# Altium schematic sheet 手柄.SchDoc
size A2
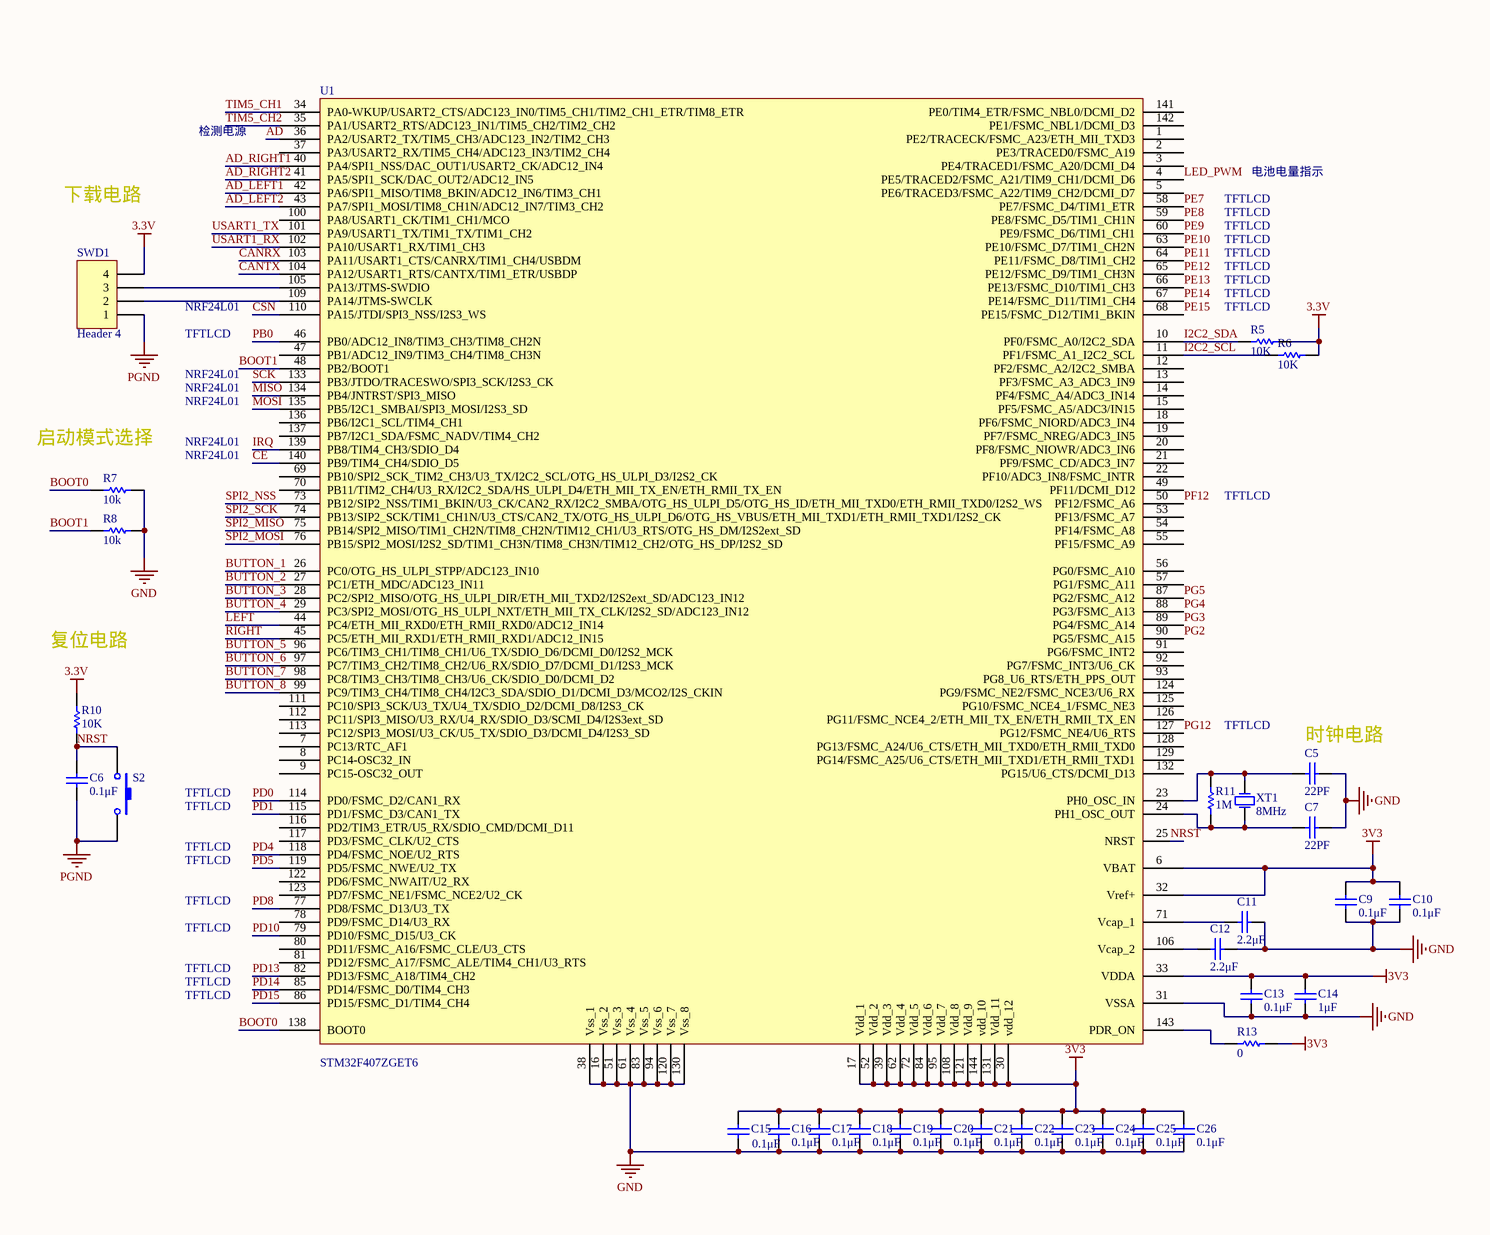
[diagram p0: 手柄.SchDoc, left]
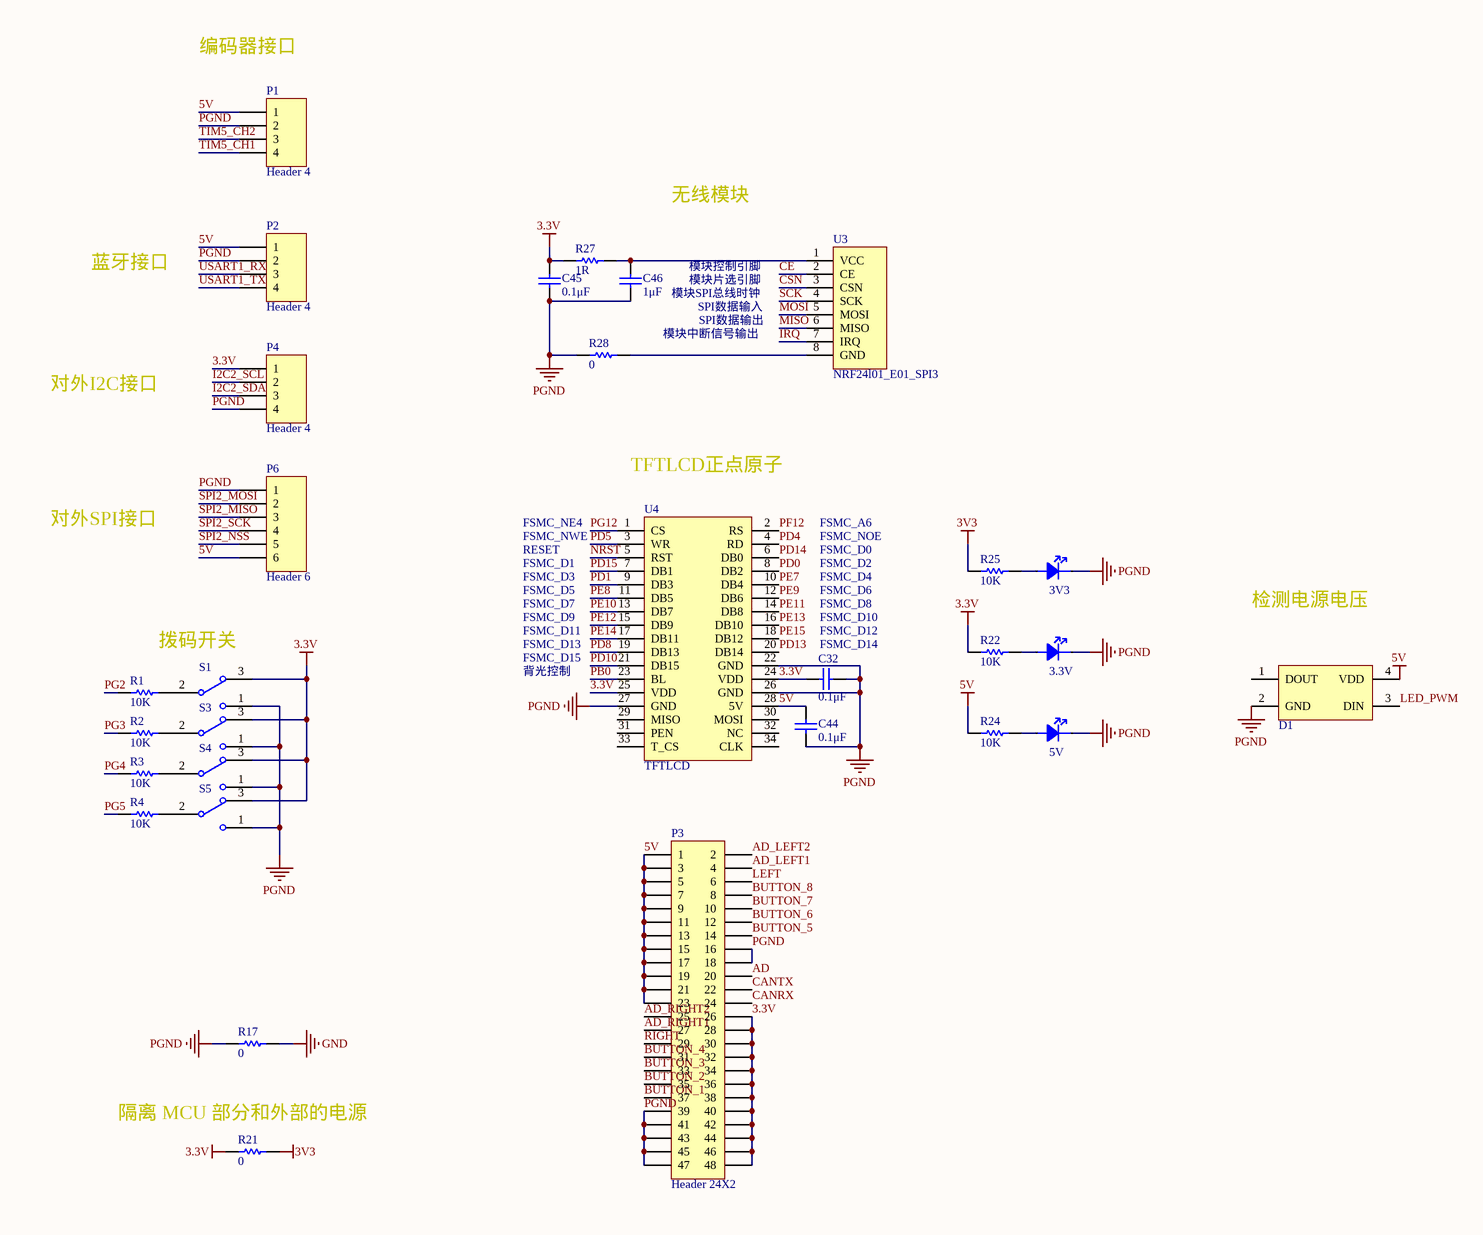
[diagram p1: 手柄.SchDoc, right]

## Parts
3.3V  lED  [0805D]  (value not drawn)
3V3  lED  [0805D]  (value not drawn)
5V  lED  [0805D]  (value not drawn)
C5  22PF  [CAP-MLCC-0603]
C6  0.1μF  [CAP-MLCC-0603]
C7  22PF  [CAP-MLCC-0603]
C9  0.1μF  [CAP-MLCC-0603]
C10  0.1μF  [CAP-MLCC-0603]
C11  2.2μF  [CAP-MLCC-0603]
C12  2.2μF  [CAP-MLCC-0603]
C13  0.1μF  [CAP-MLCC-0603]
C14  1μF  [CAP-MLCC-0603]
C15  0.1μF  [CAP-MLCC-0603]
C16  0.1μF  [CAP-MLCC-0603]
C17  0.1μF  [CAP-MLCC-0603]
C18  0.1μF  [CAP-MLCC-0603]
C19  0.1μF  [CAP-MLCC-0603]
C20  0.1μF  [CAP-MLCC-0603]
C21  0.1μF  [CAP-MLCC-0603]
C22  0.1μF  [CAP-MLCC-0603]
C23  0.1μF  [CAP-MLCC-0603]
C24  0.1μF  [CAP-MLCC-0603]
C25  0.1μF  [CAP-MLCC-0603]
C26  0.1μF  [CAP-MLCC-0603]
C32  0.1μF  [CAP-MLCC-0603]
C44  0.1μF  [CAP-MLCC-0603]
C45  0.1μF  [CAP-MLCC-0603]
C46  1μF  [CAP-MLCC-0603]
D1  LED_3535_SK6812  [LED_3535_4P]  (value not drawn)
P1  Header 4  [HDR1X4]
P2  Header 4  [HDR1X4]
P3  Header 24X2  [手柄下板]
P4  Header 4  [HDR1X4]
P6  Header 6  [Header 6]
R1  value 10K  [RES-0603]  (hidden comment: Res1)
R2  value 10K  [RES-0603]  (hidden comment: Res1)
R3  value 10K  [RES-0603]  (hidden comment: Res1)
R4  value 10K  [RES-0603]  (hidden comment: Res1)
R5  value 10K  [RES-0603]  (hidden comment: Res1)
R6  value 10K  [RES-0603]  (hidden comment: Res1)
R7  value 10k  [RES-0603]  (hidden comment: Res1)
R8  value 10k  [RES-0603]  (hidden comment: Res1)
R10  value 10K  [RES-0603]  (hidden comment: Res1)
R11  value 1M  [RES-0603]  (hidden comment: Res1)
R13  value 0  [RES-0603]  (hidden comment: Res1)
R17  value 0  [RES-0603]  (hidden comment: Res1)
R21  value 0  [RES-0603]  (hidden comment: Res1)
R22  value 10K  [RES-0603]  (hidden comment: Res1)
R24  value 10K  [RES-0603]  (hidden comment: Res1)
R25  value 10K  [RES-0603]  (hidden comment: Res1)
R27  value 1R  [RES-0603]  (hidden comment: Res1)
R28  value 0  [RES-0603]  (hidden comment: Res1)
S1  SW-SPDT  [拨码开关]  (value not drawn)
S2  SW-PB  [KEY]  (value not drawn)
S3  SW-SPDT  [拨码开关]  (value not drawn)
S4  SW-SPDT  [拨码开关]  (value not drawn)
S5  SW-SPDT  [拨码开关]  (value not drawn)
SWD1  Header 4  [HDR1X4]
U1  STM32F407ZGET6  [LQFP144-L]
U3  NRF24l01_E01_SPI3  [E01-ML01SP2]
U4  TFTLCD  [TFTLCD]
XT1  value 8MHz  [XT_5032_2]  (hidden comment: XTAL_5032_2P)

## Nets
3.3V: C32.1 C45.2 P3.26 P3.28 P3.30 P3.32 P3.34 P3.36 P3.38 P3.40 P3.42 P3.44 P3.46 P3.48 P4.1 R5.2 R6.2 R10.1 R21.1 R22.1 R27.1 S1.3 S3.3 S4.3 S5.3 SWD1.4 U4.24(VDD) U4.25(VDD)
3V3: C9.2 C10.2 C13.2 C14.2 C15.2 C16.2 C17.2 C18.2 C19.2 C20.2 C21.2 C22.2 C23.2 C24.2 C25.2 C26.2 R13.2 R21.2 R25.1 U1.6(VBAT) U1.17(Vdd_1) U1.30(vdd_12) U1.32(Vref+) U1.33(VDDA) U1.39(Vdd_3) U1.52(Vdd_2) U1.62(Vdd_4) U1.72(Vdd_5) U1.84(Vdd_6) U1.95(Vdd_7) U1.108(Vdd_8) U1.121(Vdd_9) U1.131(Vdd_11) U1.144(vdd_10)
5V: C44.1 D1.4(VDD) P1.1 P2.1 P3.1 P3.3 P3.5 P3.7 P3.9 P3.11 P3.13 P3.15 P3.17 P3.19 P3.21 P3.23 P6.6 R24.1 U4.28(5V)
GND: C5.2 C7.2 C9.1 C10.1 C11.2 C12.2 C13.1 C14.1 C15.1 C16.1 C17.1 C18.1 C19.1 C20.1 C21.1 C22.1 C23.1 C24.1 C25.1 C26.1 R7.2 R8.2 R17.2 U1.16(Vss_2) U1.31(VSSA) U1.38(Vss_1) U1.51(Vss_3) U1.61(Vss_4) U1.83(Vss_5) U1.94(Vss_6) U1.120(Vss_7) U1.130(Vss_8)
PGND: 3.3V.K 3V3.K 5V.K C6.1 C32.2 C44.2 C45.1 C46.1 D1.2(GND) P1.2 P2.2 P3.16 P3.18 P3.39 P3.41 P3.43 P3.45 P3.47 P4.4 P6.1 R17.1 R28.1 S1.1 S2.2 S3.1 S4.1 S5.1 SWD1.1 U4.22(GND) U4.26(GND) U4.27(GND)
AD: P3.20 U1.36(PA2/USART2_TX/TIM5_CH3/ADC123_IN2/TIM2_CH3)
AD_LEFT1: P3.4 U1.42(PA6/SPI1_MISO/TIM8_BKIN/ADC12_IN6/TIM3_CH1)
AD_LEFT2: P3.2 U1.43(PA7/SPI1_MOSI/TIM8_CH1N/ADC12_IN7/TIM3_CH2)
AD_RIGHT1: P3.27 U1.40(PA4/SPI1_NSS/DAC_OUT1/USART2_CK/ADC12_IN4)
AD_RIGHT2: P3.25 U1.41(PA5/SPI1_SCK/DAC_OUT2/ADC12_IN5)
BOOT0: R7.1 U1.138(BOOT0)
BOOT1: R8.1 U1.48(PB2/BOOT1)
BUTTON_1: P3.37 U1.26(PC0/OTG_HS_ULPI_STPP/ADC123_IN10)
BUTTON_2: P3.35 U1.27(PC1/ETH_MDC/ADC123_IN11)
BUTTON_3: P3.33 U1.28(PC2/SPI2_MISO/OTG_HS_ULPI_DIR/ETH_MII_TXD2/I2S2ext_SD/ADC123_IN12)
BUTTON_4: P3.31 U1.29(PC3/SPI2_MOSI/OTG_HS_ULPI_NXT/ETH_MII_TX_CLK/I2S2_SD/ADC123_IN12)
BUTTON_5: P3.14 U1.96(PC6/TIM3_CH1/TIM8_CH1/U6_TX/SDIO_D6/DCMI_D0/I2S2_MCK)
BUTTON_6: P3.12 U1.97(PC7/TIM3_CH2/TIM8_CH2/U6_RX/SDIO_D7/DCMI_D1/I2S3_MCK)
BUTTON_7: P3.10 U1.98(PC8/TIM3_CH3/TIM8_CH3/U6_CK/SDIO_D0/DCMI_D2)
BUTTON_8: P3.8 U1.99(PC9/TIM3_CH4/TIM8_CH4/I2C3_SDA/SDIO_D1/DCMI_D3/MCO2/I2S_CKIN)
CANRX: P3.24 U1.103(PA11/USART1_CTS/CANRX/TIM1_CH4/USBDM)
CANTX: P3.22 U1.104(PA12/USART1_RTS/CANTX/TIM1_ETR/USBDP)
CE: U1.140(PB9/TIM4_CH4/SDIO_D5) U3.2(CE)
CSN: U1.110(PA15/JTDI/SPI3_NSS/I2S3_WS) U3.3(CSN)
I2C2_SCL: P4.2 R6.1 U1.11(PF1/FSMC_A1_I2C2_SCL)
I2C2_SDA: P4.3 R5.1 U1.10(PF0/FSMC_A0/I2C2_SDA)
IRQ: U1.139(PB8/TIM4_CH3/SDIO_D4) U3.7(IRQ)
LED_PWM: D1.3(DIN) U1.4(PE5/TRACED2/FSMC_A21/TIM9_CH1/DCMI_D6)
LEFT: P3.6 U1.44(PC4/ETH_MII_RXD0/ETH_RMII_RXD0/ADC12_IN14)
MISO: U1.134(PB4/JNTRST/SPI3_MISO) U3.6(MISO)
MOSI: U1.135(PB5/I2C1_SMBAI/SPI3_MOSI/I2S3_SD) U3.5(MOSI)
NRST: C6.2 R10.2 S2.1 U1.25(NRST) U4.5(RST)
PB0: U1.46(PB0/ADC12_IN8/TIM3_CH3/TIM8_CH2N) U4.23(BL)
PD0: U1.114(PD0/FSMC_D2/CAN1_RX) U4.8(DB2)
PD1: U1.115(PD1/FSMC_D3/CAN1_TX) U4.9(DB3)
PD4: U1.118(PD4/FSMC_NOE/U2_RTS) U4.4(RD)
PD5: U1.119(PD5/FSMC_NWE/U2_TX) U4.3(WR)
PD8: U1.77(PD8/FSMC_D13/U3_TX) U4.19(DB13)
PD10: U1.79(PD10/FSMC_D15/U3_CK) U4.21(DB15)
PD13: U1.82(PD13/FSMC_A18/TIM4_CH2) U4.20(DB14)
PD14: U1.85(PD14/FSMC_D0/TIM4_CH3) U4.6(DB0)
PD15: U1.86(PD15/FSMC_D1/TIM4_CH4) U4.7(DB1)
PE7: U1.58(PE7/FSMC_D4/TIM1_ETR) U4.10(DB4)
PE8: U1.59(PE8/FSMC_D5/TIM1_CH1N) U4.11(DB5)
PE9: U1.60(PE9/FSMC_D6/TIM1_CH1) U4.12(DB6)
PE10: U1.63(PE10/FSMC_D7/TIM1_CH2N) U4.13(DB7)
PE11: U1.64(PE11/FSMC_D8/TIM1_CH2) U4.14(DB8)
PE12: U1.65(PE12/FSMC_D9/TIM1_CH3N) U4.15(DB9)
PE13: U1.66(PE13/FSMC_D10/TIM1_CH3) U4.16(DB10)
PE14: U1.67(PE14/FSMC_D11/TIM1_CH4) U4.17(DB11)
PE15: U1.68(PE15/FSMC_D12/TIM1_BKIN) U4.18(DB12)
PF12: U1.50(PF12/FSMC_A6) U4.2(RS)
PG2: R1.1 U1.90(PG5/FSMC_A15)
PG3: R2.1 U1.89(PG4/FSMC_A14)
PG4: R3.1 U1.88(PG3/FSMC_A13)
PG5: R4.1 U1.87(PG2/FSMC_A12)
PG12: U1.127(PG12/FSMC_NE4/U6_RTS) U4.1(CS)
RIGHT: P3.29 U1.45(PC5/ETH_MII_RXD1/ETH_RMII_RXD1/ADC12_IN15)
SCK: U1.133(PB3/JTDO/TRACESWO/SPI3_SCK/I2S3_CK) U3.4(SCK)
SPI2_MISO: P6.3 U1.75(PB14/SPI2_MISO/TIM1_CH2N/TIM8_CH2N/TIM12_CH1/U3_RTS/OTG_HS_DM/I2S2ext_SD)
SPI2_MOSI: P6.2 U1.76(PB15/SPI2_MOSI/I2S2_SD/TIM1_CH3N/TIM8_CH3N/TIM12_CH2/OTG_HS_DP/I2S2_SD)
SPI2_NSS: P6.5 U1.73(PB12/SIP2_NSS/TIM1_BKIN/U3_CK/CAN2_RX/I2C2_SMBA/OTG_HS_ULPI_D5/OTG_HS_ID/ETH_MII_TXD0/ETH_RMII_TXD0/I2S2_WS)
SPI2_SCK: P6.4 U1.74(PB13/SIP2_SCK/TIM1_CH1N/U3_CTS/CAN2_TX/OTG_HS_ULPI_D6/OTG_HS_VBUS/ETH_MII_TXD1/ETH_RMII_TXD1/I2S2_CK)
TIM5_CH1: P1.4 U1.34(PA0-WKUP/USART2_CTS/ADC123_IN0/TIM5_CH1/TIM2_CH1_ETR/TIM8_ETR)
TIM5_CH2: P1.3 U1.35(PA1/USART2_RTS/ADC123_IN1/TIM5_CH2/TIM2_CH2)
USART1_RX: P2.3 U1.102(PA10/USART1_RX/TIM1_CH3)
USART1_TX: P2.4 U1.101(PA9/USART1_TX/TIM1_TX/TIM1_CH2)
Net3.3V_A: 3.3V.A R22.2
Net3V3_A: 3V3.A R25.2
Net5V_A: 5V.A R24.2
NetC5_1: C5.1 R11.2 U1.23(PH0_OSC_IN) XT1.1(OSC1)
NetC7_1: C7.1 R11.1 U1.24(PH1_OSC_OUT) XT1.2(OSC2)
NetC11_1: C11.1 U1.71(Vcap_1)
NetC12_1: C12.1 U1.106(Vcap_2)
NetC46_2: C46.2 R27.2 U3.1(VCC)
NetR1_2: R1.2 S1.2
NetR2_2: R2.2 S3.2
NetR3_2: R3.2 S4.2
NetR4_2: R4.2 S5.2
NetR13_1: R13.1 U1.143(PDR_ON)
NetR28_2: R28.2 U3.8(GND)
NetSWD1_2: SWD1.2 U1.109(PA14/JTMS-SWCLK)
NetSWD1_3: SWD1.3 U1.105(PA13/JTMS-SWDIO)

Not connected (* = marked no-connect by the designer): D1 1(DOUT); U1 1(PE2/TRACECK/FSMC_A23/ETH_MII_TXD3) 2(PE3/TRACED0/FSMC_A19) 3(PE4/TRACED1/FSMC_A20/DCMI_D4) 5(PE6/TRACED3/FSMC_A22/TIM9_CH2/DCMI_D7) 7(PC13/RTC_AF1) 8(PC14-OSC32_IN) 9(PC15-OSC32_OUT) 12(PF2/FSMC_A2/I2C2_SMBA) 13(PF3/FSMC_A3_ADC3_IN9) 14(PF4/FSMC_A4/ADC3_IN14) 15(PF5/FSMC_A5/ADC3/IN15) 18(PF6/FSMC_NIORD/ADC3_IN4) 19(PF7/FSMC_NREG/ADC3_IN5) 20(PF8/FSMC_NIOWR/ADC3_IN6) 21(PF9/FSMC_CD/ADC3_IN7) 22(PF10/ADC3_IN8/FSMC_INTR) 37(PA3/USART2_RX/TIM5_CH4/ADC123_IN3/TIM2_CH4) 47(PB1/ADC12_IN9/TIM3_CH4/TIM8_CH3N) 49(PF11/DCMI_D12) 53(PF13/FSMC_A7) 54(PF14/FSMC_A8) 55(PF15/FSMC_A9) 56(PG0/FSMC_A10) 57(PG1/FSMC_A11) 69(PB10/SPI2_SCK_TIM2_CH3/U3_TX/I2C2_SCL/OTG_HS_ULPI_D3/I2S2_CK) 70(PB11/TIM2_CH4/U3_RX/I2C2_SDA/HS_ULPI_D4/ETH_MII_TX_EN/ETH_RMII_TX_EN) 78(PD9/FSMC_D14/U3_RX) 80(PD11/FSMC_A16/FSMC_CLE/U3_CTS) 81(PD12/FSMC_A17/FSMC_ALE/TIM4_CH1/U3_RTS) 91(PG6/FSMC_INT2) 92(PG7/FSMC_INT3/U6_CK) 93(PG8_U6_RTS/ETH_PPS_OUT) 100(PA8/USART1_CK/TIM1_CH1/MCO) 111(PC10/SPI3_SCK/U3_TX/U4_TX/SDIO_D2/DCMI_D8/I2S3_CK) 112(PC11/SPI3_MISO/U3_RX/U4_RX/SDIO_D3/SCMI_D4/I2S3ext_SD) 113(PC12/SPI3_MOSI/U3_CK/U5_TX/SDIO_D3/DCMI_D4/I2S3_SD) 116(PD2/TIM3_ETR/U5_RX/SDIO_CMD/DCMI_D11) 117(PD3/FSMC_CLK/U2_CTS) 122(PD6/FSMC_NWAIT/U2_RX) 123(PD7/FSMC_NE1/FSMC_NCE2/U2_CK) 124(PG9/FSMC_NE2/FSMC_NCE3/U6_RX) 125(PG10/FSMC_NCE4_1/FSMC_NE3) 126(PG11/FSMC_NCE4_2/ETH_MII_TX_EN/ETH_RMII_TX_EN) 128(PG13/FSMC_A24/U6_CTS/ETH_MII_TXD0/ETH_RMII_TXD0) 129(PG14/FSMC_A25/U6_CTS/ETH_MII_TXD1/ETH_RMII_TXD1) 132(PG15/U6_CTS/DCMI_D13) 136(PB6/I2C1_SCL/TIM4_CH1) 137(PB7/I2C1_SDA/FSMC_NADV/TIM4_CH2) 141(PE0/TIM4_ETR/FSMC_NBL0/DCMI_D2) 142(PE1/FSMC_NBL1/DCMI_D3); U4 29(MISO) 30(MOSI) 31(PEN) 32(NC) 33(T_CS) 34(CLK)

## Notes on the sheet
- 编码器接口
- 检测电源
- 电池电量指示
- 下载电路
- TFTLCD
- 无线模块
- NRF24L01
- 蓝牙接口
- (near C46) 模块SPI总线时钟
- 模块控制引脚
- 模块片选引脚
- SPI数据输入
- 模块中断信号输出
- SPI数据输出
- (near R7) 启动模式选择
- 对外I2C接口
- TFTLCD正点原子
- 对外SPI接口
- FSMC_NE4
- FSMC_NWE
- FSMC_D1
- FSMC_D3
- RESET
- FSMC_D4
- FSMC_D2
- FSMC_D0
- FSMC_NOE
- FSMC_A6
- 复位电路
- 拨码开关
- FSMC_D5
- FSMC_D7
- FSMC_D9
- FSMC_D11
- FSMC_D13
- (near C32) FSMC_D14
- (near C32) FSMC_D12
- FSMC_D10
- FSMC_D8
- FSMC_D6
- 检测电源电压
- FSMC_D15
- 背光控制
- (near C5) 时钟电路
- (near R21) 隔离 MCU 部分和外部的电源

## Library data of the parts
3.3V 3V3 5V = 00-D-LED
C5-C7 C9-C26 C32 C44-C46 = CAP: 无极性电容; Value: *μF; Published: 8-Jun-2000; LatestRevisionDate: 17-Jul-2002; LatestRevisionNote: Re-released for DXP Platform.; PackageReference: RAD-0.3; Publisher: Altium Limited; PackageDescription: Radial Cap, Thru-Hole; 2 Leads; 0.3 in Pin Spacing
D1 = LED_3535_SK6812: LED
P1 P2 P4 SWD1 = Header 4: Header, 4-Pin; LatestRevisionDate: 17-Jul-2002; LatestRevisionNote: Re-released for DXP Platform.; Publisher: Altium Limited
P3 = Header 24X2: Header, 24-Pin, Dual row; LatestRevisionDate: 17-Jul-2002; LatestRevisionNote: Re-released for DXP Platform.; Publisher: Altium Limited
P6 = Header 6: Header, 6-Pin; LatestRevisionDate: 17-Jul-2002; LatestRevisionNote: Re-released for DXP Platform.; Publisher: Altium Limited
R1-R8 R10 R11 R13 R17 R21 R22 R24 R25 R27 R28 = Res1: Resistor; Published: 8-Jun-2000; LatestRevisionDate: 17-Jul-2002; LatestRevisionNote: Re-released for DXP Platform.; PackageReference: AXIAL-0.3; Publisher: Altium Limited
S1 S3-S5 = SW-SPDT: 单刀双掷开关; Published: 24-Mar-1999; LatestRevisionDate: 17-Dec-2003; LatestRevisionNote: Schematic revised, PCB Footprint replaced.; DatasheetVersion: 05-Dec-2000; PackageReference: TL36WW15050; Publisher: Altium Limited; PackageDescription: Switch; 4 Leads; ComponentLink1Description: Manufacturer Link; ComponentLink1URL: http://www.apem.com
S2 = SW-PB: 按钮; Published: 24-Mar-1999; LatestRevisionDate: 17-Jul-2002; LatestRevisionNote: Re-released for DXP Platform.; PackageReference: SPST-2; Publisher: Altium Limited; PackageDescription: Switch; 2 Leads
U1 = Component_1
U3 = NRF24l01_E01_SPI2
XT1 = XTAL_5032_2P: Crystal Oscillator